# EAGLE design CANNode (EAGLE 9.6.2)
DESCRIPTION: microOBD 200 OBD-II Module; HW_REV: 1.4; PCB_REV: C; PCB_SPEC1: Layer Count: 4; PCB_SPEC2: Size: 1.3" x 0.59"; PCB_SPEC3: Finish Thickness: 0.049" - 0.052"; PCB_SPEC4: Copper Weight: 1oz; TITLE: STM1120

## Sheet 1 of 2
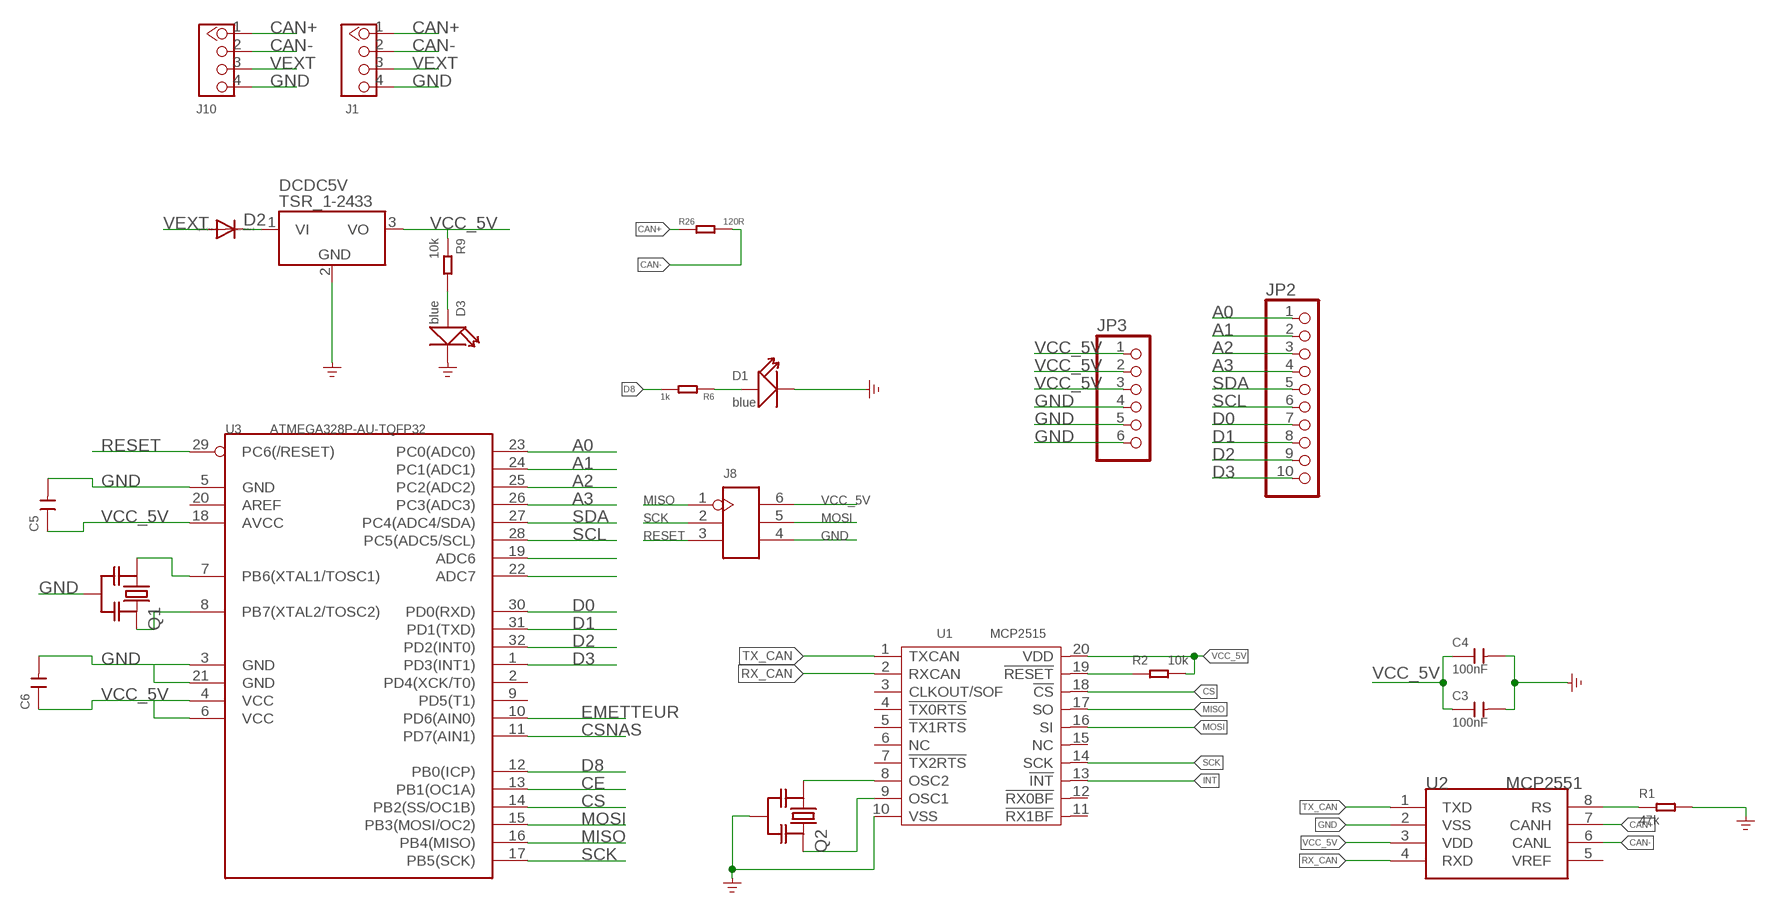
[diagram p0: schematic, sheet 1]

### Parts
C3  100nF  CAP-0805  [C0805]
C4  100nF  CAP-0805  [C0805]
C5  CAP-0805  [C0805]
C6  CAP-0805  [C0805]
D1  blue  LED-0805  [LED-0805]
D2  DIODE-SOD323-W  [SOD323-W]
D3  blue  LED-0805  [LED-0805]
DCDC5V  TSR_1-2433  [TSR-1]
J1  320110033  GROVE-CONNECTOR-DIP-2.0  [HW4-2.0]
J8  HEADER-2X3P-2.54  [H2X3-2.54]
J10  320110033  GROVE-CONNECTOR-DIP-2.0  [HW4-2.0]
JP2  PINHD-1X10  [1X10]
JP3  PINHD-1X6  [1X06]
Q1  RESONATOR-MURATACST_CE  [RESONATOR_MURATA2]
Q2  RESONATOR-MURATACST_CE  [RESONATOR_MURATA2]
R1  47k  RES-0805  [R0805]
R2  10k  RES-0603  [R0603]
R6  1k  RES-0805  [R0805]
R9  10k  RES-0805  [R0805]
R26  120R  RES-0805  [R0805]
U1  MCP2515  MCP2515'ST'  [TSSOP20-0.65-6.5X4.4MM]
U2  MCP2551  MCP2551-SOIC8  [SOIC8-6.0]
U3  ATMEGA328P-AU-TQFP32  MCU-ATMEGA328P-AU(TQFP32)  [TQFP32-0.8-7X7MM]

### Nets
A0: JP2.1 U3.23(PC0(ADC0))
A1: JP2.2 U3.24(PC1(ADC1))
A2: JP2.3 U3.25(PC2(ADC2))
A3: JP2.4 U3.26(PC3(ADC3))
CAN+: J1.1 J10.1 R26.1 U2.7(CANH)
CAN-: J1.2 J10.2 R26.2 U2.6(CANL)
CE: U3.13(PB1(OC1A))
CS: U1.18(!CS) U3.14(PB2(SS/OC1B))
CSNAS: U3.11(PD7(AIN1))
D0: JP2.7 U3.30(PD0(RXD))
D1: JP2.8 U3.31(PD1(TXD))
D2: JP2.9 U3.32(PD2(INT0))
D3: JP2.10 U3.1(PD3(INT1))
D8: R6.2 U3.12(PB0(ICP))
EMETTEUR: U3.10(PD6(AIN0))
GND: C3.2 C4.2 C5.2 C6.2 D1.- D3.- DCDC5V.2(GND) J1.4 J8.4 J10.4 JP3.4 JP3.5 JP3.6 Q1.2 Q2.2 R1.2 U1.10(VSS) U2.2(VSS) U3.3(GND) U3.5(GND) U3.21(GND) ; supply symbol labelled GND_POWER
INT: U1.13(!INT)
MISO: J8.1 U1.17(SO) U3.16(PB4(MISO))
MOSI: J8.5 U1.16(SI) U3.15(PB3(MOSI/OC2))
N$1: Q1.1 U3.7(PB6(XTAL1/TOSC1))
N$2: Q1.3 U3.8(PB7(XTAL2/TOSC2))
N$3: D3.+ R9.2
N$8: D1.+ R6.1
N$11: U3.19(ADC6)
N$12: U3.22(ADC7)
N$16: Q2.1 U1.8(OSC2)
N$17: Q2.3 U1.9(OSC1)
N$20: R1.1 U2.8(RS)
RESET: J8.3 U3.29(PC6(/RESET))
RST_N: R2.1 U1.19(!RESET)
RX_CAN: U1.2(RXCAN) U2.4(RXD)
SCK: J8.2 U1.14(SCK) U3.17(PB5(SCK))
SCL: JP2.6 U3.28(PC5(ADC5/SCL))
SDA: JP2.5 U3.27(PC4(ADC4/SDA))
TX_CAN: U1.1(TXCAN) U2.1(TXD)
VCC_5V: C3.1 C4.1 C5.1 C6.1 DCDC5V.3(VO) J8.6 JP3.1 JP3.2 JP3.3 R2.2 R9.1 U1.20(VDD) U2.3(VDD) U3.4(VCC) U3.6(VCC) U3.18(AVCC)
VEXT: D2.A J1.3 J10.3
VI: D2.C DCDC5V.1(VI)
Unconnected: U1.3(CLKOUT/SOF) U1.4(!TX0RTS) U1.5(!TX1RTS) U1.6(NC) U1.7(!TX2RTS) U1.11(!RX1BF) U1.12(!RX0BF) U1.15(NC) U2.5(VREF) U3.2(PD4(XCK/T0)) U3.9(PD5(T1)) U3.20(AREF)

## Sheet 2 of 2

## Library data of the parts
C3-C6 = Discrete:CAP: Ceramic Capacitors
D1 D3 = Discrete:LED
D2 = diode:DIODE-: DIODE
DCDC5V = _traco_tsr-1:TSR_1-*: TRACO TSR-1 Series Point-of-Load DC/DC-Converters Vi max. 36 V; Vo = (1.2 .. 15)V ±2%; Io = 0 .. 1 A SIP-Package (drop-in replacement for 78xx linear voltage regulators in TO220-package, vertically assembled) Source: www.tracopower.com Technologies: TSR 1- Vi (V) Vo (V) ±2% Io = 0 .. 1 A 24_ ( generic ) 2412 4.6 .. 36 1.2 2415 4.6 .. 36 1.5 2418 4.6 .. 36 1.8 2425 4.6 .. 36 2.5 2433 4.75.. 36 3.3 2450 6.5 .. 36 5.0 2465 9.0 .. 36 6.5 2490 12 .. 36 9.0 24120 15 .. 36 12 24150 18 .. 36 15 Author: Dipl.-Ing. FH Rainer Bayer HHN Hochschule Heilbronn, rainer.bayer@hs-heilbronn.de Ingenieurbüro ing-rb, mail@ing-rb.de
J1 J10 = Connector-new:GROVE-CONNECTOR-DIP: 4P-2.0:320110033;4P-2.0-90D:320110034
J8 = Connector-new:HEADER-2X3P
JP2 = pinhead:PINHD-1X10: PIN HEADER
JP3 = pinhead:PINHD-1X6: PIN HEADER
Q1 Q2 = m-pad-2.1:RESONATOR-MURATA: Murata ceramic Resonator "ceralock" CSTCE series with built in load capacitance +- 0.5% tolerance 12.51MHz to 19.99MHz 16MHz murata part#: CSTCE16M0V53-R0 16MHz digikey part#: 490-1198-1-ND $1.33 each
R1 R6 R9 R26 = Seeed-OPL-Resistor:RES
R2 = Discrete-new:RES
U1 = Heilight:MCP2515
U2 = IC:MCP2551: High-Speed CAN Transceiver http://ww1.microchip.com/downloads/en/devicedoc/21667f.pdf
U3 = Seeed-OPL-ic:MCU-ATMEGA328P-AU(TQFP32): 310010049; MPN: ATMEGA328P-AU

## Net classes
0 default: width 0.305 mm, drill 0.3 mm, clearance 0.152 mm
3 usbvcc: width 0.152 mm, drill 0.152 mm, clearance 0.152 mm

## Board
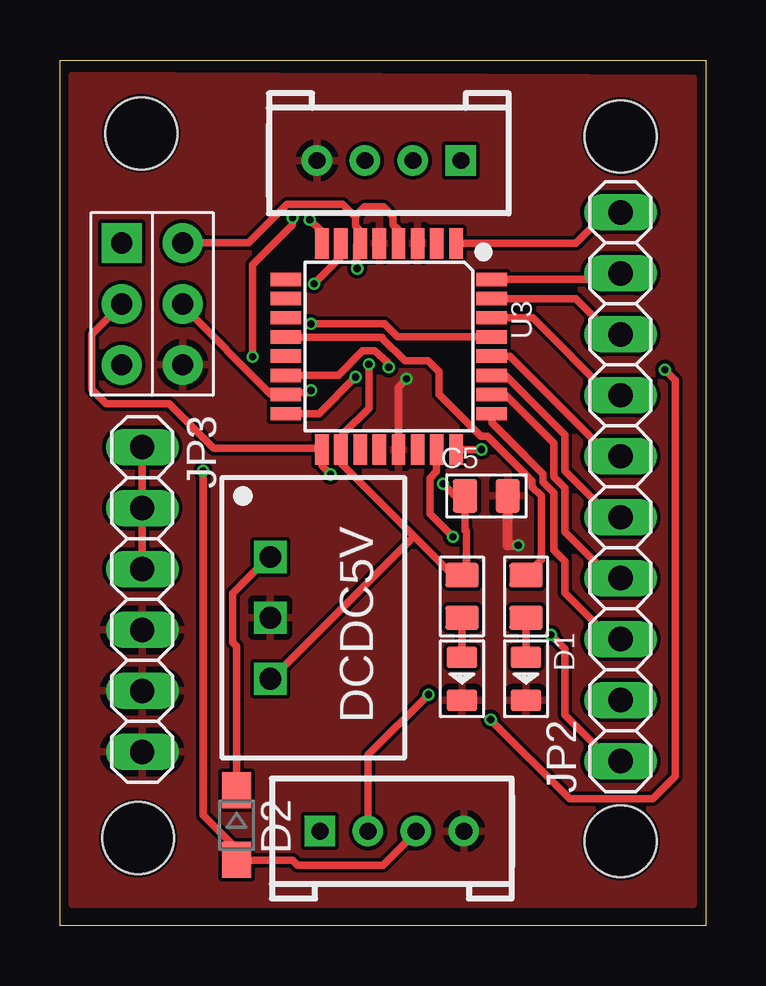
[diagram p1: board, top side]
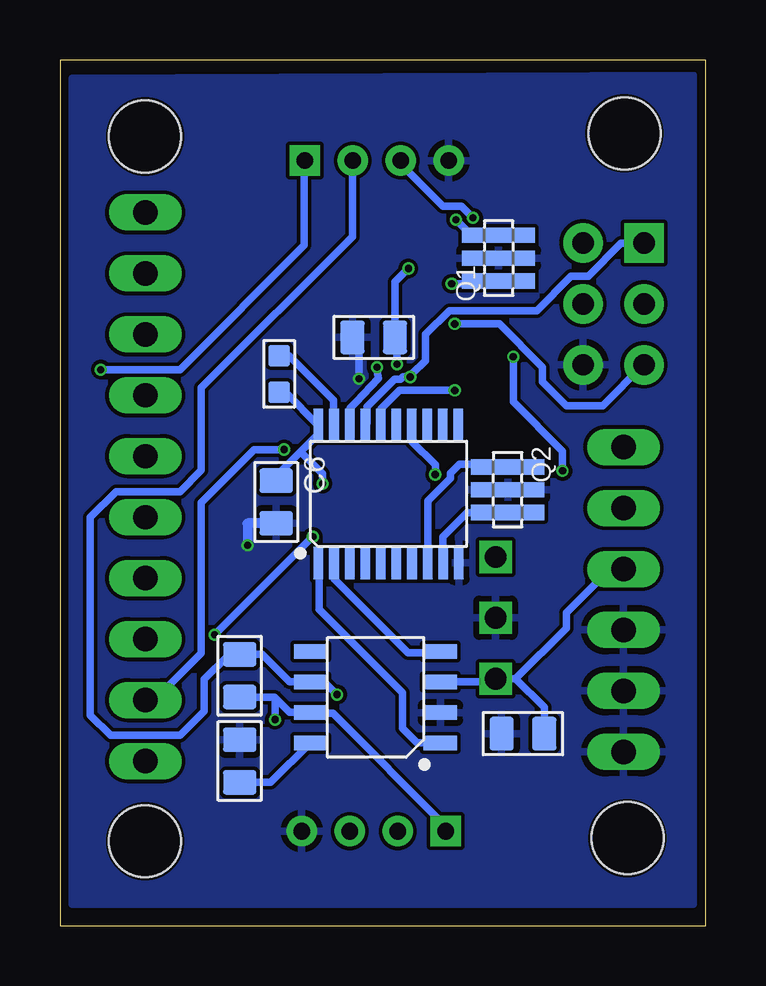
[diagram p2: board, bottom side, seen from below]

Size 26.92 x 36.07 mm. Coordinates in mm from the lower left corner, seen from the top.
Outline: 0,36.07 26.92,36.07 26.92,0 0,0 0,36.07
Copper layers (1*16): Top 0.035mm / dielectric 1.5mm / Bottom 0.035mm
Design rules "SeeedStudio_2layer_DRU_no_angle_20140221 *": minimum track width 12mil, minimum drill 0.3mm, track to track 6mil, track to pad 6mil, pad to pad 6mil, via to via 6mil, smd to smd 0mil, copper to edge 0mil, drill to drill 10mil, minimum pad ring 4mil, minimum via ring 4mil, stop-mask expansion 2mil, vias tented up to drill 25mil, thermal gap 10mil
Holes 3 mm at 3.39,33.01 3.26,3.64 23.38,32.88 23.38,3.52

### Footprints (pad centres in the part's own frame; a part is rotated, then mirrored left to right if it is on the bottom)
C0805 = smd 1.016 x 1.397: 1 -0.889,0; 2 0.889,0
LED-0805 = smd 0.889 x 1.27: + -0.889,0; - 0.889,0
SOD323-W = smd 1.5 x 1.2: A 1.45,0; C -1.45,0
TSR-1 = drill 0.9 square: 1 -2.54,0; 2 0,0; 3 2.54,0
HW4-2.0 = drill 0.7 pad 1.27 square: 1 -3,0 | drill 0.7 pad 1.27: 2 -1,0; 3 1,0; 4 3,0
H2X3-2.54 = drill 0.889 pad 1.651 square: 1 -1.27,2.54 | drill 0.889 pad 1.651: 2 -1.27,0; 3 -1.27,-2.54; 4 1.27,-2.54; 5 1.27,0; 6 1.27,2.54
1X10 = drill 1.016 long: 1 -11.43,0; 2 -8.89,0; 3 -6.35,0; 4 -3.81,0; 5 -1.27,0; 6 1.27,0; 7 3.81,0; 8 6.35,0; 9 8.89,0; 10 11.43,0
1X06 = drill 1.016 long: 1 -6.35,0; 2 -3.81,0; 3 -1.27,0; 4 1.27,0; 5 3.81,0; 6 6.35,0
RESONATOR_MURATA2 = smd 0.635 x 3.048: 1 -0.95,0; 2 0,0; 3 0.95,0
R0805 = smd 1.397 x 1.016: 1 0,0.889; 2 0,-0.889
R0603 = smd 0.889 x 0.889: 1 -0.762,0; 2 0.762,0
TSSOP20-0.65-6.5X4.4MM = smd 0.4 x 1.35: 1 -2.925,-2.875; 2 -2.275,-2.875; 3 -1.625,-2.875; 4 -0.975,-2.875; 5 -0.325,-2.875; 6 0.325,-2.875; 7 0.975,-2.875; 8 1.625,-2.875; 9 2.275,-2.875; 10 2.925,-2.875; 11 2.91,2.875; 12 2.26,2.875; 13 1.61,2.875; 14 0.96,2.875; 15 0.325,2.875; 16 -0.325,2.875; 17 -0.975,2.875; 18 -1.625,2.875; 19 -2.275,2.875; 20 -2.925,2.875
SOIC8-6.0 = smd 0.6 x 1.4: 1 -1.905,-2.7; 2 -0.635,-2.7; 3 0.635,-2.7; 4 1.905,-2.7; 5 1.905,2.7; 6 0.635,2.7; 7 -0.635,2.7; 8 -1.905,2.7
TQFP32-0.8-7X7MM = smd 1.27 x 0.559: 1 -4.293,2.8; 2 -4.293,2; 3 -4.293,1.2; 4 -4.293,0.4; 5 -4.293,-0.4; 6 -4.293,-1.2; 7 -4.293,-2; 8 -4.293,-2.8; 17 4.293,-2.8; 18 4.293,-2; 19 4.293,-1.2; 20 4.293,-0.4; 21 4.293,0.4; 22 4.293,1.2; 23 4.293,2; 24 4.293,2.8 | smd 0.559 x 1.27: 9 -2.8,-4.293; 10 -2,-4.293; 11 -1.2,-4.293; 12 -0.4,-4.293; 13 0.4,-4.293; 14 1.2,-4.293; 15 2,-4.293; 16 2.8,-4.293; 25 2.8,4.293; 26 2,4.293; 27 1.2,4.293; 28 0.4,4.293; 29 -0.4,4.293; 30 -1.2,4.293; 31 -2,4.293; 32 -2.8,4.293

### Placement (x,y rotation side)
C3  7.62,8 180 bottom
C4  13.84,24.51 180 bottom
C5  17.78,17.91 0 top
C6  17.91,17.65 270 bottom
D1  19.43,10.29 270 top
D2  7.37,4.19 270 top
D3  16.76,10.29 270 top
DCDC5V  8.76,12.83 270 top
J1  13.72,31.88 180 top
J8  3.84,25.91 0 top
J10  13.84,3.94 0 top
JP2  23.37,18.29 90 top
JP3  3.43,13.59 270 top
Q1  8.64,27.81 90 bottom
Q2  8.25,18.16 270 bottom
R1  19.43,6.86 180 bottom
R2  17.78,22.99 270 bottom
R6  19.43,13.72 180 top
R9  16.76,13.72 0 top
R26  19.43,10.41 180 bottom
U1  13.22,17.99 0 bottom
U2  13.76,9.51 90 bottom
U3  13.72,24.13 270 top

### Tracks (layer width: path | path; a pad name or v marks a point on that pad's centre or on a via)
A0  (via drill 0.3)
  Top 0.305: v16.38,16.2 15.42,17.17 15.42,18.64 15.7,18.92 15.7,19.84 U3.23 | v20.47,12.12 21.06,11.53 21.06,8.79 22.99,6.86 JP2.1
  Bottom 0.305: v20.47,12.12 v16.38,16.2
A1  (via drill 0.3)
  Top 0.305: v17.58,19.84 U3.24
  Bottom 0.305: v17.58,19.84 18.82,19.84 21.03,17.63 21.03,11.35 22.99,9.4 JP2.2
A2
  Top 0.305: U3.25 18.01,20.96 20.14,18.82 20.14,18.49 20.6,18.03 20.6,15.65 21.06,15.19 21.06,13.87 22.99,11.94 JP2.3
A3
  Top 0.305: JP2.4 22.99,14.48 21.06,16.41 21.06,18.24 20.6,18.69 20.6,20.09 18.57,22.12 U3.26
CAN+  (via drill 0.3)
  Top 0.305: v25.22,23.16 25.65,22.73 25.65,6.22 24.71,5.28 21.26,5.28 v17.96,8.59
  Bottom 0.305: R26.1 17.98,9.52 17.86,9.4 | 17.86,9.4 17.35,8.89 16.48,8.89 U2.7 16.31,8.84 15.54,8.84 10.85,4.14 J10.1 | v25.22,23.16 21.92,23.16 16.74,28.35 16.74,31.88 J1.1 | v17.96,8.59 17.96,9.3 17.86,9.4
CAN-  (via drill 0.3)
  Top 0.305: v15.37,9.63 12.85,7.11 J10.2
  Bottom 0.305: v15.37,9.63 15.85,10.11 16.31,10.11 U2.6 16.48,10.16 17.35,10.16 18.49,11.3 R26.2 19.56,11.23 19.94,11.23 20.9,10.26 20.9,8.94 21.92,7.92 24.82,7.92 25.65,8.76 25.65,17.02 24.59,18.09 21.92,18.09 21.03,18.97 21.03,22.4 14.73,28.7 14.73,31.88 J1.2
CS  (via drill 0.3)
  Top 0.305: U3.14 11.61,22.94 12.62,23.95 13.11,23.95 13.66,23.47 13.65,23.33 v13.71,23.26
  Bottom 0.305: U1.18 14.83,20.88 14.83,21.57 14.59,21.82 13.64,22.81 13.67,22.84 v13.71,23.26
D0
  Top 0.305: JP2.7 22.94,22.1 19.71,25.32 U3.30
D1
  Top 0.305: JP2.8 22.99,24.64 21.51,26.11 18.01,26.11 U3.31
D2
  Top 0.305: JP2.9 23.11,26.92 U3.32
D3
  Top 0.305: U3.1 21.51,28.42 22.81,29.72 JP2.10
D8
  Top 0.305: R6.2 20.07,15.24 20.07,17.91 19.68,18.29 19.68,18.54 17.83,20.4 17.55,20.4 15.8,22.15 15.8,23.08 15.35,23.53 14.39,23.53 13.44,24.48 13.44,24.51 9.42,24.51 U3.12
GND  (via drill 0.3)
  Top 0.305: U3.21 14.1,19.84 14.1,22.43 v14.45,22.79
  Top 0.406: v19.11,15.84 18.67,15.84 C5.2
  Bottom 0.305: v14.45,22.79 14.45,24.23 C4.2
  Bottom 0.406: C6.2 19.11,16.76 v19.11,15.84
  pour Top (isolate 0.127, rank 6): 0.51,35.43 26.42,35.31 26.42,0.89 0.51,0.89
  pour Bottom (isolate 0.127, rank 6): 0.51,35.43 26.42,35.31 26.42,0.89 0.51,0.89
MISO  (via drill 0.3)
  Top 0.305: v12.32,22.86 10.79,21.34 U3.16
  Bottom 0.305: U1.17 14.17,20.88 14.12,20.93 14.12,21.62 12.98,22.76 12.72,22.76 12.62,22.86 v12.32,22.86 12.24,22.99 11.68,23.55 11.68,24.64 10.69,25.63 7.04,25.63 5.61,27.05 4.9,27.05 3.53,28.42 2.59,28.42 J8.1
MOSI  (via drill 0.3)
  Top 0.305: J8.5 5.13,25.88 5.13,25.81 8.79,22.15 9.42,22.15 U3.15 9.55,22.2 10.36,22.2 v10.46,22.3
  Bottom 0.305: v10.46,22.3 12.78,22.3 13.54,21.54 13.54,20.88 U1.16
N$1  (via drill 0.3)
  Top 0.305: v10.59,26.75 11.71,27.86 U3.7
  Bottom 0.305: v10.59,26.75 8.74,26.75 8.64,26.85 Q1.1
N$2  (via drill 0.3)
  Top 0.305: v10.41,29.41 10.9,28.93 10.9,28.42 U3.8
  Bottom 0.305: v10.41,29.41 9.78,28.78 Q1.3
N$3
  Top 0.305: R9.2 D3.+
N$8
  Top 0.305: R6.1 D1.+
N$16
  Bottom 0.305: U1.8 11.58,15.14 11.58,17.7 10.64,18.64 10.64,18.85 10.26,19.23 8.36,19.23 8.25,19.13 Q2.1
N$17
  Bottom 0.305: U1.9 10.95,15.14 10.95,16.2 9.96,17.2 8.25,17.2 Q2.3
N$20
  Bottom 0.305: R1.1 18.14,5.97 16.48,7.62 U2.8
RESET  (via drill 0.3)
  Top 0.305: v10.46,25.07 13.54,25.07 14.07,24.54 U3.29
  Bottom 0.305: v10.46,25.07 8.61,25.07 6.81,23.27 6.81,22.66 5.82,21.67 4.29,21.67 2.59,23.37 J8.3
RST_N
  Bottom 0.305: R2.1 17.37,23.75 15.52,21.89 15.52,20.88 U1.19
RX_CAN
  Bottom 0.305: U1.2 15.49,14.45 12.42,11.38 11.1,11.38 11.07,11.41 U2.4
SCK  (via drill 0.3)
  Top 0.305: v11.28,18.8 10.92,19.15 U3.17 10.77,19.89 6.4,19.89 4.55,21.74 1.93,21.74 1.32,22.35 1.32,24.64 2.56,25.88 J8.2
  Bottom 0.305: v11.28,18.8 11.28,19.2 12.24,20.17 12.24,20.85 U1.14
SCL
  Top 0.305: JP2.6 22.94,19.56 18.77,23.72 U3.28
SDA
  Top 0.305: JP2.5 22.99,17.02 21.06,18.95 21.06,20.45 18.59,22.91 18.01,22.91 U3.27
TX_CAN
  Bottom 0.305: U1.1 16.13,15.11 16.13,13.18 12.65,9.7 12.65,8.23 12.04,7.62 11.07,7.62 U2.1
VCC_5V  (via drill 0.3)
  Top 0.305: 12.32,29.57 12.32,29.16 12.5,28.98 12.5,28.42 U3.6 12.37,28.35 12.37,27.71 12.29,27.64 12.29,27.48 v12.39,27.38 | 12.32,29.57 12.7,29.95 13.49,29.95 13.89,29.54 13.89,29.21 14.1,29.01 14.1,28.42 U3.4 | J8.6 5.13,28.45 7.87,28.45 9.47,30.05 11.79,30.05 12.19,29.64 12.32,29.57 | 14.76,16.23 16.38,14.61 R9.1 16.84,14.73 16.94,14.83 16.94,16.43 16.89,16.48 C5.1 16.76,17.63 v15.98,18.41 | 14.76,16.23 11.73,19.25 11.73,19.84 U3.18 11.81,19.96 11.81,20.5 12.88,21.57 v12.88,23.39 | JP3.3 JP3.2 JP3.1 | 14.76,16.23 8.81,10.29 DCDC5V.3
  Bottom 0.305: v12.39,27.38 12.95,26.82 C4.1 12.88,24.38 v12.88,23.39 | R2.2 17.53,22.23 16.15,20.85 U1.20 16.18,20.7 16.18,20.45 16.89,19.74 | C6.1 17.91,18.72 16.89,19.74 | 16.89,19.74 15.98,18.82 v15.98,18.41 | C3.1 6.73,9.09 7.92,10.29 | 7.92,10.29 DCDC5V.3 8.84,10.16 11.05,10.16 U2.3 | 7.92,10.29 5.82,12.4 5.82,13.03 3.99,14.86 JP3.3
VEXT  (via drill 0.3)
  Top 0.305: J10.3 14.83,3.94 14.83,3.89 13.46,2.52 9.91,2.52 9.7,2.72 7.37,2.72 D2.A 7.72,2.84 5.97,4.6 v5.97,18.95 | v9.7,29.49 9.7,29.21 8.03,27.53 v8.03,23.7
  Bottom 0.305: v9.7,29.49 10.18,29.97 10.95,29.97 12.7,31.73 12.7,31.88 J1.3 | v8.03,23.7 8.03,21.82 5.97,19.76 v5.97,18.95
VI
  Top 0.305: D2.C 7.37,11.63 7.19,11.81 7.19,13.84 8.71,15.37 DCDC5V.1